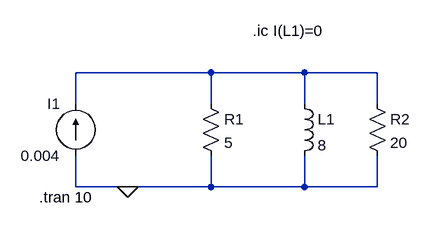
[diagram p0: schematic Q7_60.asc]
Q7_60.asc, the LTspice schematic file:
Version 4
SHEET 1 880 680
WIRE 304 112 96 112
WIRE 448 112 304 112
WIRE 560 112 448 112
WIRE 96 160 96 112
WIRE 304 160 304 112
WIRE 448 160 448 112
WIRE 560 160 560 112
WIRE 96 288 96 240
WIRE 176 288 96 288
WIRE 304 288 304 240
WIRE 304 288 176 288
WIRE 448 288 448 240
WIRE 448 288 304 288
WIRE 560 288 560 240
WIRE 560 288 448 288
FLAG 176 288 0
SYMBOL res 288 144 R0
SYMATTR InstName R1
SYMATTR Value 5
SYMBOL res 544 144 R0
SYMATTR InstName R2
SYMATTR Value 20
SYMBOL ind 432 144 R0
SYMATTR InstName L1
SYMATTR Value 8
SYMBOL current 96 240 R180
WINDOW 0 24 80 Left 2
WINDOW 3 24 0 Left 2
WINDOW 123 0 0 Left 0
WINDOW 39 0 0 Left 0
SYMATTR InstName I1
SYMATTR Value 0.004
TEXT 40 304 Left 2 !.tran 10
TEXT 368 48 Left 2 !.ic I(L1)=0

The netlist it stands for:
* Q7_60.asc
R1 N001 0 5
R2 N001 0 20
L1 N001 0 8
I1 0 N001 0.004
.tran 10
.ic I(L1)=0
.backanno
.end